# Altium schematic sheet ProjectAir_Sch.SchDoc
size A4
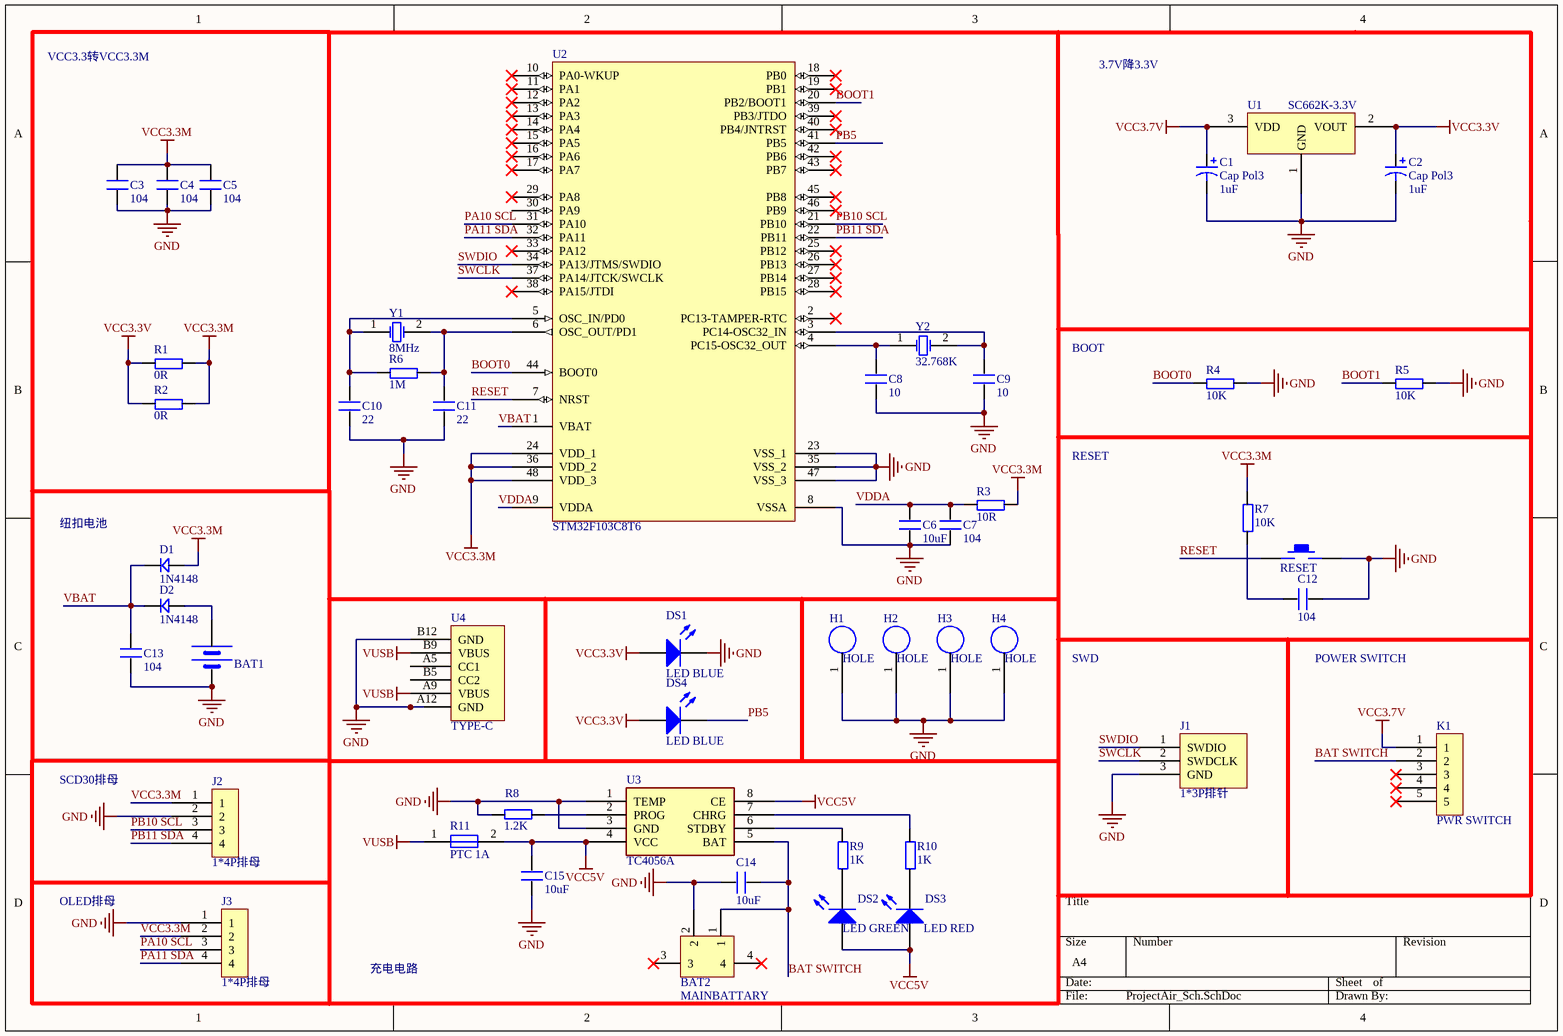
[diagram p0: ProjectAir_Sch.SchDoc]

## Parts
BAT1  BATT  [BAT_RTC]  (value not drawn)
BAT2  MAINBATTARY  [MAINBAT]
C1  Cap Pol3  value 1uF  [C Pol]
C2  Cap Pol3  value 1uF  [C Pol]
C3  104  [0805]
C4  104  [0805]
C5  104  [0805]
C6  10uF  [0805]
C7  104  [0805]
C8  10  [0805]
C9  10  [0805]
C10  22  [0805]
C11  22  [0805]
C12  104  [0805]
C13  104  [0805]
C14  10uF  [0805]
C15  10uF  [0805]
D1  1N4148  [SOD-123]
D2  1N4148  [SOD-123]
DS1  LED BLUE  [0805D]
DS2  LED GREEN  [0805D]
DS3  LED RED  [0805D]
DS4  LED BLUE  [0805D]
H1  HOLE  [M2孔]
H2  HOLE  [M2孔]
H3  HOLE  [M2孔]
H4  HOLE  [M2孔]
J1  1*3P排针  [1*3Pin]
J2  1*4P排母  [1*4Pin]
J3  1*4P排母  [1*4Pin]
K1  PWR SWITCH  [PWR SWITCH]
R1  0R  [0805R]
R2  0R  [0805R]
R3  10R  [0805R]
R4  10K  [0805R]
R5  10K  [0805R]
R6  1M  [0805R]
R7  10K  [0805R]
R8  1.2K  [0805R]
R9  1K  [0805R]
R10  1K  [0805R]
R11  PTC 1A  [PTC]
RESET  KEY_M  [SMD]  (value not drawn)
U1  SC662K-3.3V  [SOT23-3]
U2  STM32F103C8T6  [STM32F103C8T6]
U3  TC4056A  [ESOP-8]
U4  TYPE-C  [TYPE-C]
Y1  8MHz  [SMD-5032_2P]
Y2  32.768K  [SMD_1610]

## Blocks framed on the sheet
VCC3.3转VCC3.3M: C3-C5 R1 R2

## Nets
GND: BAT1.2(GND) BAT2.2 C1.2 C2.2 C3.1 C4.1 C5.1 C6.1 C7.1 C8.1 C9.1 C10.1 C11.1 C12.2 C13.1 C14.1 C15.1 DS1.2(K) H1.1(GND) H2.1(GND) H3.1(GND) H4.1(GND) J1.3(GND) J2.2 J3.1 R4.2 R5.2 R8.2 RESET.2 U1.1(GND) U2.8(VSSA) U2.23(VSS_1) U2.35(VSS_2) U2.47(VSS_3) U3.1(TEMP) U3.3(GND) U4.A12(GND) U4.B12(GND)
VCC3.3M: C3.2 C4.2 C5.2 D1.1 J2.1 J3.2 R1.2 R2.2 R3.2 R7.2 U2.24(VDD_1) U2.36(VDD_2) U2.48(VDD_3)
VCC3.3V: C2.1 DS1.1(A) DS4.1(A) R1.1 R2.1 U1.2(VOUT)
VCC3.7V: C1.1 K1.1 U1.3(VDD)
VCC5V: C15.2 DS2.1(A) DS3.1(A) R11.2 U3.4(VCC) U3.8(CE)
VUSB: R11.1 U4.A9(VBUS) U4.B9(VBUS)
BAT SWITCH: BAT2.1 C14.2 K1.2 U3.5(BAT)
BOOT0: R4.1 U2.44(BOOT0)
BOOT1: R5.1 U2.20(PB2/BOOT1)
PA10 SCL: J3.3 U2.31(PA10)
PA11 SDA: J3.4 U2.32(PA11)
PB5: DS4.2(K) U2.41(PB5)
PB10 SCL: J2.3 U2.21(PB10)
PB11 SDA: J2.4 U2.22(PB11)
RESET: RESET.1 U2.7(NRST)
SWCLK: J1.2(SWDCLK) U2.37(PA14/JTCK/SWCLK)
SWDIO: J1.1(SWDIO) U2.34(PA13/JTMS/SWDIO)
VBAT: C13.2 D1.2 D2.2 U2.1(VBAT)
VDDA: C6.2 C7.2 R3.1 U2.9(VDDA)
NetBAT1_1: BAT1.1(VCC) D2.1
NetC8_2: C8.2 U2.4(PC15-OSC32_OUT) Y2.1(OSC1)
NetC9_2: C9.2 U2.3(PC14-OSC32_IN) Y2.2(OSC2)
NetC10_2: C10.2 R6.1 U2.5(OSC_IN/PD0) Y1.1(OSC1)
NetC11_2: C11.2 R6.2 U2.6(OSC_OUT/PD1) Y1.2(OSC2)
NetC12_1: C12.1 R7.1
NetDS2_2: DS2.2(K) R9.1
NetDS3_2: DS3.2(K) R10.1
NetR8_1: R8.1 U3.2(PROG)
NetR9_2: R9.2 U3.6(STDBY)
NetR10_2: R10.2 U3.7(CHRG)

Not connected (* = marked no-connect by the designer): BAT2 3* 4*; K1 3* 4* 5*; U2 2(PC13-TAMPER-RTC)* 10(PA0-WKUP)* 11(PA1)* 12(PA2)* 13(PA3)* 14(PA4)* 15(PA5)* 16(PA6)* 17(PA7)* 18(PB0)* 19(PB1)* 25(PB12)* 26(PB13)* 27(PB14)* 28(PB15)* 29(PA8)* 30(PA9) 33(PA12)* 38(PA15/JTDI)* 39(PB3/JTDO)* 40(PB4/JNTRST)* 42(PB6)* 43(PB7)* 45(PB8)* 46(PB9)*; U4 A5(CC1) B5(CC2)

## Notes on the sheet
- 3.7V降3.3V
- BOOT
- RESET
- 纽扣电池
- SWD
- POWER SWITCH
- SCD30排母
- OLED排母
- 充电电路

## Library data of the parts
BAT1 = BAT
BAT2 = MAINBAT
C1 C2 = Cap Pol3: Polarized Capacitor (Surface Mount); Published: 8-Jun-2000; LatestRevisionDate: 29-May-2009; LatestRevisionNote: IPC-7351 Footprint Added.; PackageReference: C0805; Publisher: Altium Limited; PackageDescription: Chip Capacitor
C3-C13 = C
C14 C15 = C_2
D1 D2 = D
DS1-DS4 = LED2: Typical RED, GREEN, YELLOW, AMBER GaAs LED; Published: 8-Jun-2000; LatestRevisionDate: 17-Jul-2002; LatestRevisionNote: Re-released for DXP Platform.; PackageDocument: Feb-2002; PackageReference: 3.2X1.6X1.1; Publisher: Altium Limited
H1-H4 = M2孔
J2 J3 = 1*4P排母: 排母
R1-R7 = R
R8-R10 = R_1
R11 = PTC保险
U1 = SC662K-3.3V: SCK662K-3.3V
U2 = STM32F103C8T6: STM32 ARM-based 32-bit MCU with 64 Kbytes Flash, 48-pin LQFP, Industrial Temperature; Published: 30-May-2008; DatasheetVersion: rev6, Mar-2008; PackageVersion: Mar-2008; PackageReference: LQFP48; Publisher: Altium Limited; PackageDescription: 48-Pin Low-Profile Quad Flat Pack, 7 x 7 mm Body, 0.5 mm Pitch (LQFP48); ComponentLink1Description: Manufacturer Link; ComponentLink1URL: www.st.com/stm32; ComponentLink2Description: Datasheet; ComponentLink2URL: http://www.st.com/stonline/products/literature/ds/13587.pdf
U3 = TC4056A: 充电芯片
Y1 = XTAL: Crystal Oscillator; Published: 8-Jun-2000; LatestRevisionDate: 17-Jul-2002; LatestRevisionNote: Re-released for DXP Platform.; Publisher: Altium Limited
Y2 = XTAL_1: Crystal Oscillator; Published: 8-Jun-2000; LatestRevisionDate: 17-Jul-2002; LatestRevisionNote: Re-released for DXP Platform.; Publisher: Altium Limited